# Altium schematic sheet PWR612A_SH1.SchDoc: TPS23861EVM Motherboard
size 558 x 431 mm; Engineer: E. Wright; Revision: A; Name: E. Wright
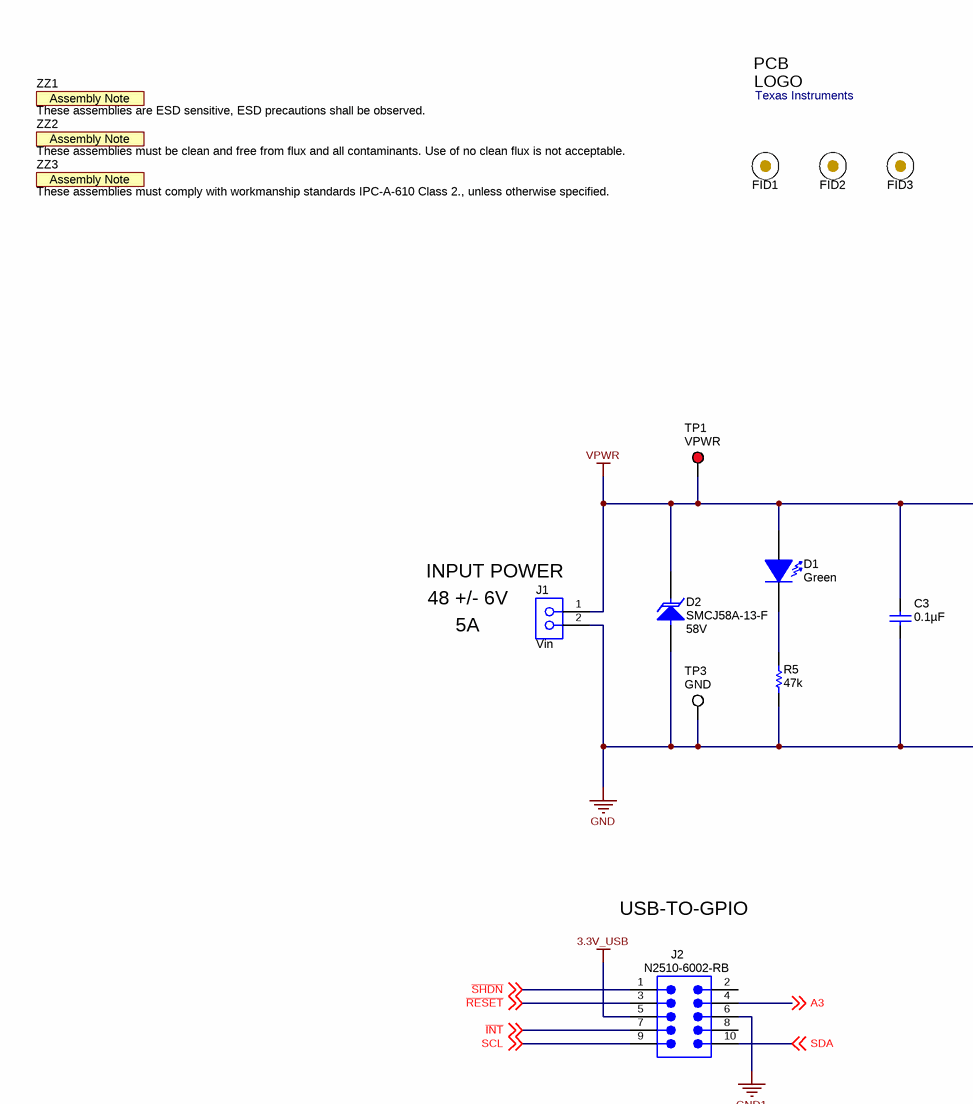
[diagram p0: PWR612A_SH1.SchDoc, top left]
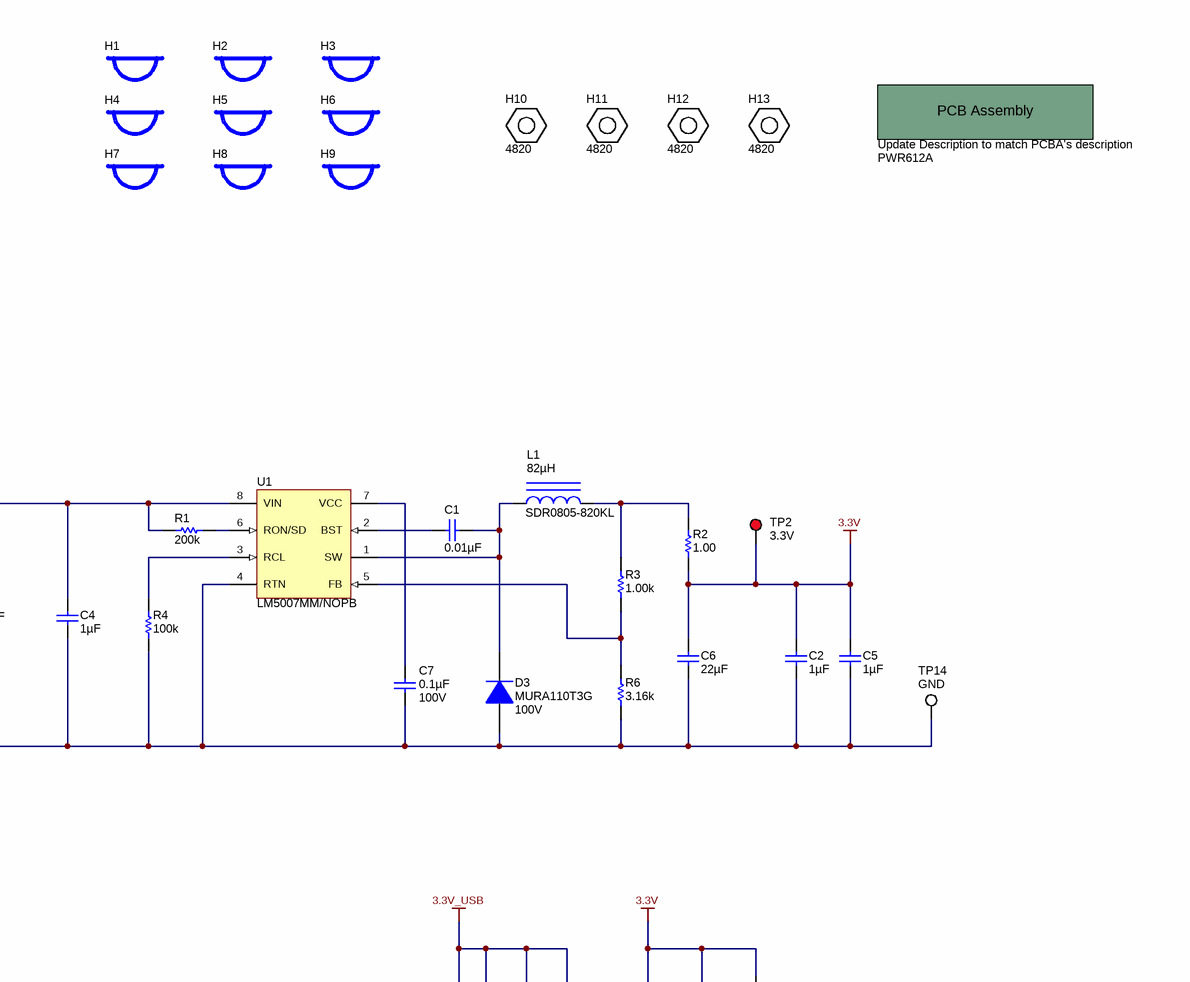
[diagram p1: PWR612A_SH1.SchDoc, top right]
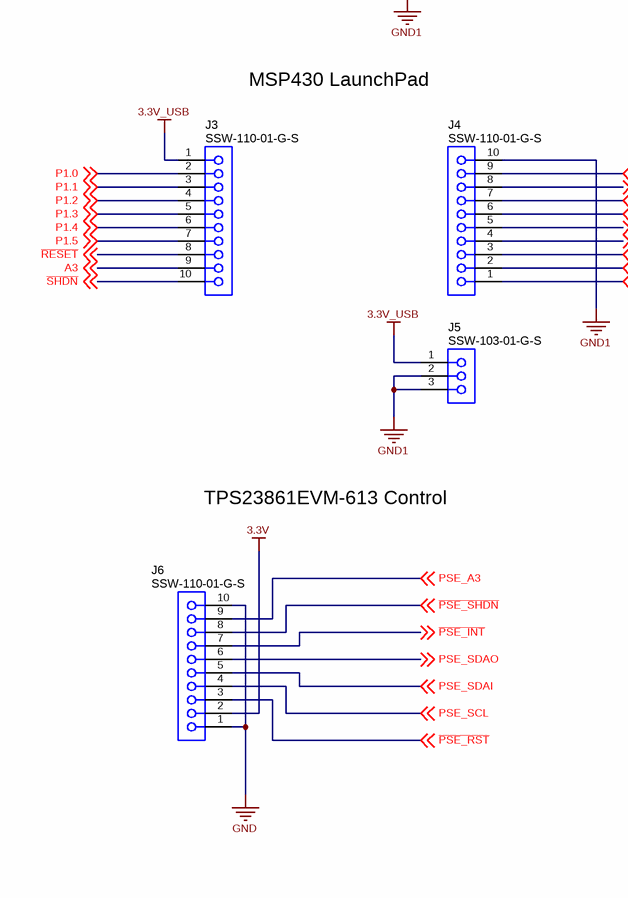
[diagram p2: PWR612A_SH1.SchDoc, bottom left]
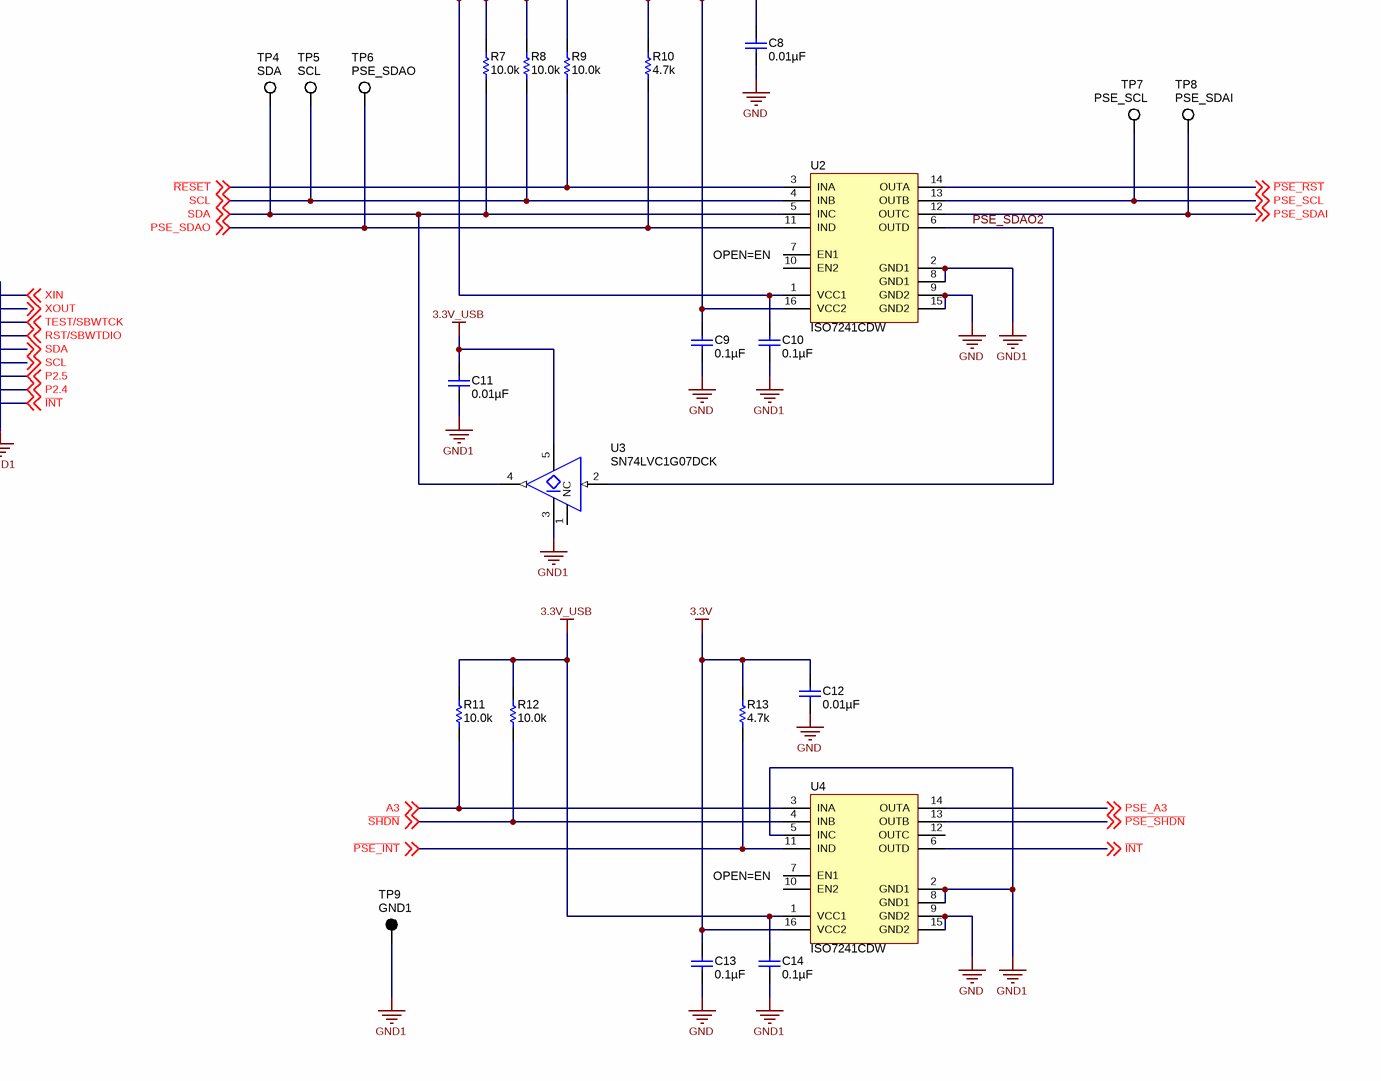
[diagram p3: PWR612A_SH1.SchDoc, bottom right]

## Parts
!PCBA?  Update Description to match PCBA's description  PartNumber: PWR612A  (mechanical)
C1  ValueDisplayed: 0.01µF  [0603]  (hidden comment: 06031C103KAT2A)
C2  ValueDisplayed: 1µF  [0805]  (hidden comment: 0805ZC105KAT2A)
C3  ValueDisplayed: 0.1µF  [0805_HV]  (hidden comment: C2012X7R2A104K)
C4  ValueDisplayed: 1µF  [1206]  (hidden comment: GRM31CR72A105KA01L)
C5  ValueDisplayed: 1µF  [0805]  (hidden comment: 0805ZC105KAT2A)
C6  ValueDisplayed: 22µF  [1206]  (hidden comment: GRM31CR71A226KE15L)
C7  ValueDisplayed: 0.1µF  Value2: 100V  [0805_HV]  (hidden comment: C2012X7R2A104K)
C8  ValueDisplayed: 0.01µF  [0603]  (hidden comment: 06031C103KAT2A)
C9  ValueDisplayed: 0.1µF  [0603]  (hidden comment: 06035C104KAT2A)
C10  ValueDisplayed: 0.1µF  [0603]  (hidden comment: 06035C104KAT2A)
C11  ValueDisplayed: 0.01µF  [0603]  (hidden comment: 06031C103KAT2A)
C12  ValueDisplayed: 0.01µF  [0603]  (hidden comment: 06031C103KAT2A)
C13  ValueDisplayed: 0.1µF  [0603]  (hidden comment: 06035C104KAT2A)
C14  ValueDisplayed: 0.1µF  [0603]  (hidden comment: 06035C104KAT2A)
D1  value Green  [LED_PowerTOPLED_CB_lens]  (hidden comment: LT E63C-CADB-35-L-Z)
D2  SMCJ58A-13-F  value 58V  [SMC]
D3  MURA110T3G  value 100V  [SMA]
FID1  Fiducial  [Fiducial10-20]  (value not drawn)  (no BOM)
FID2  Fiducial  [Fiducial10-20]  (value not drawn)  (no BOM)
FID3  Fiducial  [Fiducial10-20]  (value not drawn)  (no BOM)
H1  SJ61A1  [Bumpon_SJ61A1]  (value not drawn)
H2  SJ61A1  [Bumpon_SJ61A1]  (value not drawn)
H3  SJ61A1  [Bumpon_SJ61A1]  (value not drawn)
H4  SJ61A1  [Bumpon_SJ61A1]  (value not drawn)
H5  SJ61A1  [Bumpon_SJ61A1]  (value not drawn)
H6  SJ61A1  [Bumpon_SJ61A1]  (value not drawn)
H7  SJ61A1  [Bumpon_SJ61A1]  (value not drawn)
H8  SJ61A1  [Bumpon_SJ61A1]  (value not drawn)
H9  SJ61A1  [Bumpon_SJ61A1]  (value not drawn)
H10  4820  [KEYSTONE_4820]
H11  4820  [KEYSTONE_4820]
H12  4820  [KEYSTONE_4820]
H13  4820  [KEYSTONE_4820]
J1  Vin  [CONN_ED120-2DS]
J2  N2510-6002-RB  [CONN_2510-6002]
J3  SSW-110-01-G-S  [CONN_SSW-110-23-F-S]
J4  SSW-110-01-G-S  [CONN_SSW-110-23-F-S]
J5  SSW-103-01-G-S  [CONN_SSW-103-01-G-S]
J6  SSW-110-01-G-S  [CONN_SSW-110-23-F-S]
L1  SDR0805-820KL  ValueDisplayed: 82µH  [SDR0805]
Logo1  Texas Instruments  [TI_Stacked_Overlay_Medium]  (no BOM)
R1  value 200k  [0603]  (hidden comment: CRCW0603200KFKEA)
R2  value 1.00  [1206]  (hidden comment: CRCW12061R00FKEA)
R3  value 1.00k  [0603]  (hidden comment: CRCW06031K00FKEA)
R4  value 100k  [0603]  (hidden comment: CRCW0603100KFKEA)
R5  value 47k  [0603]  (hidden comment: CRCW060347K0JNEA)
R6  value 3.16k  [0603]  (hidden comment: CRCW06033K16FKEA)
R7  value 10.0k  [0603]  (hidden comment: CRCW060310K0FKEA)
R8  value 10.0k  [0603]  (hidden comment: CRCW060310K0FKEA)
R9  value 10.0k  [0603]  (hidden comment: CRCW060310K0FKEA)
R10  value 4.7k  [0603]  (hidden comment: CRCW06034K70JNEA)
R11  value 10.0k  [0603]  (hidden comment: CRCW060310K0FKEA)
R12  value 10.0k  [0603]  (hidden comment: CRCW060310K0FKEA)
R13  value 4.7k  [0603]  (hidden comment: CRCW06034K70JNEA)
TP1  VPWR  [Keystone5010]
TP2  3.3V  [Keystone5010]
TP3  GND  [Testpoint_Keystone_Compact]
TP4  SDA  [Keystone5012]
TP5  SCL  [Keystone5012]
TP6  PSE_SDAO  [Keystone5012]
TP7  PSE_SCL  [Keystone5012]
TP8  PSE_SDAI  [Keystone5012]
TP9  GND1  [Keystone5011]
TP14  GND  [Testpoint_Keystone_Compact]
U1  LM5007MM/NOPB  [MUA08A_N]
U2  ISO7241CDW  [DW0016A_N]
U3  SN74LVC1G07DCK  [DCK0005A_N]
U4  ISO7241CDW  [DW0016A_N]
ZZ1  These assemblies are ESD sensitive, ESD precautions shall be observed.  [AssemblyNote]  (no BOM)
ZZ2  These assemblies must be clean and free from flux and all contaminants. Use of no clean flux is not acceptable.  [AssemblyNote]  (no BOM)
ZZ3  These assemblies must comply with workmanship standards IPC-A-610 Class 2., unless otherwise specified.  [AssemblyNote]  (no BOM)

## Nets
3.3V: C2.1 C5.1 C6.1 C8.2 C9.1 C12.2 C13.1 J6.2 R2.2 R10.2 R13.2 TP2.1 U2.16(VCC2) U4.16(VCC2)
3.3V_USB: C10.1 C11.2 C14.1 J2.5 J3.1 J5.1 R7.2 R8.2 R9.2 R11.2 R12.2 U2.1(VCC1) U3.5(VCC) U4.1(VCC1)
GND: C2.2 C3.2 C4.2 C5.2 C6.2 C7.2 C8.1 C9.2 C12.1 C13.2 D2.2(A) D3.2(A) J1.2 J6.1 J6.10 R4.1 R5.1 R6.1 TP3.1 TP14.1 U1.4(RTN) U2.9(GND2) U2.15(GND2) U4.9(GND2) U4.15(GND2)
GND1: C10.2 C11.1 C14.2 J2.6 J4.10 J5.2 J5.3 TP9.1 U2.2(GND1) U2.8(GND1) U3.3(GND) U4.2(GND1) U4.5(INC) U4.8(GND1)
VPWR: C3.1 C4.1 D1.4(A) D2.1(K) J1.1 R1.1 TP1.1 U1.8(VIN)
~{INT}: J2.7 J4.1 U4.6(OUTD) ; off-sheet ~{INT}
~{PSE_INT}: J6.7 R13.1 U4.11(IND) ; off-sheet ~{PSE_INT}
~{PSE_RST}: J6.3 U2.14(OUTA) ; off-sheet ~{PSE_RST}
~{PSE_SHDN}: J6.8 U4.13(OUTB) ; off-sheet ~{PSE_SHDN}
~{RESET}: J2.3 J3.8 R9.1 U2.3(INA) ; off-sheet ~{RESET}
~{SHDN}: J2.1 J3.10 R12.1 U4.4(INB) ; off-sheet ~{SHDN}
A3: J2.4 J3.9 R11.1 U4.3(INA) ; off-sheet A3
P1.0: J3.2 ; off-sheet P1.0
P1.1: J3.3 ; off-sheet P1.1
P1.2: J3.4 ; off-sheet P1.2
P1.3: J3.5 ; off-sheet P1.3
P1.4: J3.6 ; off-sheet P1.4
P1.5: J3.7 ; off-sheet P1.5
P2.4: J4.2 ; off-sheet P2.4
P2.5: J4.3 ; off-sheet P2.5
PSE_A3: J6.9 U4.14(OUTA) ; off-sheet PSE_A3
PSE_SCL: J6.4 TP7.1 U2.13(OUTB) ; off-sheet PSE_SCL
PSE_SDAI: J6.5 TP8.1 U2.12(OUTC) ; off-sheet PSE_SDAI
PSE_SDAO: J6.6 R10.1 TP6.1 U2.11(IND) ; off-sheet PSE_SDAO
PSE_SDAO2: U2.6(OUTD) U3.2(A)
RST/SBWTDIO: J4.6 ; off-sheet RST/SBWTDIO
SCL: J2.9 J4.4 R8.1 TP5.1 U2.4(INB) ; off-sheet SCL
SDA: J2.10 J4.5 R7.1 TP4.1 U2.5(INC) U3.4(Y) ; off-sheet SDA
TEST/SBWTCK: J4.7 ; off-sheet TEST/SBWTCK
XIN: J4.9 ; off-sheet XIN
XOUT: J4.8 ; off-sheet XOUT
NetC1_1: C1.1 U1.2(BST)
NetC1_2: C1.2 D3.1(K) L1.1 U1.1(SW)
NetC7_1: C7.1 U1.7(VCC)
NetD1_2: D1.2(K) R5.2
NetL1_2: L1.2 R2.1 R3.2
NetR1_2: R1.2 U1.6(RON/SD)
NetR3_1: R3.1 R6.2 U1.5(FB)
NetR4_2: R4.2 U1.3(RCL)

Not connected (* = marked no-connect by the designer): J2 2 8; U2 7(EN1) 10(EN2); U3 1(NC); U4 7(EN1) 10(EN2) 12(OUTC)

## Notes on the sheet
- (near J1) 48 +/- 6V
- (near J1) INPUT POWER
- 5A
- USB-TO-GPIO
- MSP430 LaunchPad
- (near U2) OPEN=EN
- TPS23861EVM-613 Control
- (near U4) OPEN=EN
- Drawn By:
- SVN Rev:
- Number:
- Rev:
- Sheet Title:
- File:
- Project Title:
- Designed for:
- Assembly Variant:
- Mod. Date:
- Sheet:
- Size:
- of
- C
- http://www.ti.com
- Texas Instruments and/or its licensors do not warrant the accuracy or completeness of this specification or any information contained therein. Texas Instruments and/or its licensors do not warrant that this design will meet the specifications, will be suitable for your application or fit for any particular purpose, or will operate in an implementation. Texas Instruments and/or its licensors do not warrant that the design is production worthy. You should completely validate and test your design implementation to confirm the system functionality for your application.
- Engineer:
- Contact:
- © Texas Instruments
- (in symbol AssemblyNote) Assembly Note
- (in symbol PCBA) PCB Assembly
- (in symbol TI_Logo) PCB; LOGO

## Library data of the parts
!PCBA? = PCBA: Manufacturer: Any; SymbolCreator: a0412235; U/M: EA; SymbolVersion: 2012-09-03; PackageReference: N/A; RoHS: Y; MountType: N/A; CompType: PCBA; ComponentLink1URL: Paste URL for datasheet here; Publisher: Texas Instruments; LatestRevisionDate: 2013-12-05; LatestRevisionNote: Added Alternate PartNumber and Alternate Manufacturer parameters to appropriate components.
C1 C8 C11 C12 = 06031C103KAT2A: CAP, CERM, 0.01uF, 100V, +/-10%, X7R, 0603; Manufacturer: AVX; Polarized: N; CompType: Capacitor; U/M: EA; Cap_F: 0.00000001; Tolerance_%: 10; ESR_Ohm: 0.098; Value1: 0.098 ohm; VDC_V: 100; TaMin_C: -55; TaMax_C: 125; SymbolVersion: 2008-07-09; Value: 0.01uF; PartNumber: 06031C103KAT2A; PackageReference: 0603; RoHS: Y; Value2: 100V; MountType: SMT; Technology: Ceramic; TempCo: X7R; Cap_Case: 0603; Published: 2008-06-19; Publisher: Texas Instruments; LatestRevisionDate: 2013-07-02; ComponentLink1Description: Datasheet link; ComponentLink1URL: http://www.avx.com/docs/masterpubs/smccp.pdf; Supplier 1: Digi-Key; Supplier Part Number 1: 478-1205-1-ND; Supplier 2: Mouser; Supplier Part Number 2: 581-06031C103K; Supplier 3: Farnell; Supplier Part Number 3: 1327671
C2 C5 = 0805ZC105KAT2A: CAP, CERM, 1uF, 10V, +/-10%, X7R, 0805; Manufacturer: AVX; Polarized: N; CompType: Capacitor; U/M: EA; Cap_F: 0.000001; Tolerance_%: 10; ESR_Ohm: 0.008; Value1: 0.008 ohm; TaMin_C: -55; TaMax_C: 125; SymbolVersion: 2008-07-09; Value: 1uF; PartNumber: 0805ZC105KAT2A; PackageReference: 0805; RoHS: Y; VDC_V: 10; Value2: 10V; MountType: SMT; Technology: Ceramic; TempCo: X7R; Cap_Case: 0805; Published: 2008-06-19; Publisher: Texas Instruments; LatestRevisionDate: 2013-07-02; ComponentLink1Description: Datasheet link; ComponentLink1URL: http://www.avx.com/docs/masterpubs/smccp.pdf; Supplier 1: Digi-Key; Supplier Part Number 1: 478-1405-1-ND; Supplier 2: Mouser; Supplier Part Number 2: 581-0805ZC105K; Supplier 3: Farnell; Supplier Part Number 3: 1327700
C3 C7 = C2012X7R2A104K: CAP, CERM, 0.1uF, 100V, +/-10%, X7R, 0805; Manufacturer: TDK; Polarized: N; CompType: Capacitor; U/M: EA; Cap_F: 0.0000001; Tolerance_%: 10; ESR_Ohm: 0.0158; Value1: 0.0158 ohm; VDC_V: 100; TaMin_C: -55; TaMax_C: 125; Cap_Case: 0805; SymbolVersion: 2008-07-09; Value: 0.1uF; PartNumber: C2012X7R2A104K; PackageReference: 0805; RoHS: Y; MountType: SMT; Technology: Ceramic; TempCo: X7R; Published: 2008-06-19; Publisher: Texas Instruments; LatestRevisionDate: 2013-06-14; ComponentLink1Description: Datasheet link; ComponentLink1URL: http://www.tdk.co.jp/tefe02/e412_c.pdf; Supplier 1: Digi-Key; Supplier Part Number 1: 445-1418-1-ND; Supplier 2: Farnell; Supplier Part Number 2: 1844410
  C3: Value2: 100V
C4 = GRM31CR72A105KA01L: CAP, CERM, 1uF, 100V, +/-10%, X7R, 1206; Manufacturer: MuRata; Polarized: N; CompType: Capacitor; U/M: EA; Cap_F: 0.000001; Tolerance_%: 10; Value1: Unknown; VDC_V: 100; TaMin_C: -55; TaMax_C: 125; Cap_Case: 2220; SymbolVersion: 2008-07-09; Value: 1uF; PartNumber: GRM31CR72A105KA01L; PackageReference: 1206; RoHS: Y; Value2: 100V; MountType: SMT; Technology: Ceramic; TempCo: X7R; Published: 2008-06-19; Publisher: Texas Instruments; LatestRevisionDate: 2013-07-02; ComponentLink1Description: Datasheet link; ComponentLink1URL: http://search.murata.co.jp/Ceramy/PnsearchViewAction.do?HnOFG=ON&HnNFG=ON&SEL_CNT=50&sLang=en&sKey=GRM31CR72A105KA01L&x=9&y=9&search=startwith; Supplier 1: Digi-Key; Supplier Part Number 1: 490-3909-1-ND; Supplier 2: Mouser; Supplier Part Number 2: 81-GRM31CR72A105KA01; Supplier 3: Farnell; Supplier Part Number 3: 1735543
C6 = GRM31CR71A226KE15L: CAP, CERM, 22uF, 10V, +/-10%, X7R, 1206; Manufacturer: MuRata; Polarized: N; CompType: Capacitor; U/M: EA; Cap_F: 0.000022; Tolerance_%: 10; Value1: Unknown; TaMin_C: -55; TaMax_C: 125; SymbolVersion: 2008-07-09; Value: 22uF; PartNumber: GRM31CR71A226KE15L; PackageReference: 1206; RoHS: Y; VDC_V: 10; Value2: 10V; MountType: SMT; Technology: Ceramic; TempCo: X7R; Cap_Case: 1206; Published: 2008-06-19; Publisher: Texas Instruments; LatestRevisionDate: 2013-12-06; ComponentLink1Description: Datasheet link; ComponentLink1URL: http://search.murata.co.jp/Ceramy/PnsearchViewAction.do?HnOFG=ON&HnNFG=ON&SEL_CNT=50&sLang=en&sKey=GRM31CR71A226KE15L&x=9&y=9&search=startwith; Supplier 1: Digi-Key; Supplier Part Number 1: 490-5309-1-ND; Supplier 2: Mouser; Supplier Part Number 2: 81-GRM31CR71A226K15L; Supplier 3: Farnell; Supplier Part Number 3: 1797016
C9 C10 C13 C14 = 06035C104KAT2A: CAP, CERM, 0.1uF, 50V, +/-10%, X7R, 0603; Manufacturer: AVX; Polarized: N; CompType: Capacitor; U/M: EA; Cap_F: 0.0000001; Tolerance_%: 10; Value1: Unknown; VDC_V: 50; TaMin_C: -55; TaMax_C: 125; SymbolVersion: 2008-07-09; Value: 0.1uF; PartNumber: 06035C104KAT2A; PackageReference: 0603; RoHS: Y; Value2: 50V; MountType: SMT; Technology: Ceramic; TempCo: X7R; Cap_Case: 0603; Published: 2008-06-19; Publisher: Texas Instruments; LatestRevisionDate: 2013-08-08; ComponentLink1Description: Datasheet link; ComponentLink1URL: http://www.avx.com/docs/Catalogs/cx7r.pdf; Supplier 1: Digi-Key; Supplier Part Number 1: 478-5052-1-ND; Supplier 2: Mouser; Supplier Part Number 2: 581-06035C104KAT2A; Supplier 3: Farnell; Supplier Part Number 3: 1301804
D1 = LT E63C-CADB-35-L-Z: LED, Green, SMD; Manufacturer: OSRAM; Type: InGaN; Vf_V: 3.8; Value2: 3.8V; Io_A: 0.03; Vr_V: 5; RJC_CperW: 180; Tjmax_C: 125; Power_TotalModule: 0.114; Value1: 0.114W; LambdaP: 520; LambdaD: 525; NumParallelLEDs: 1; LuminousFlux_PhiV: 1.482; Angle: 20; FamilyName: Power TOPLED&#174;; U/M: EA; CompType: LED; PartNumber: LT E63C-CADB-35-L-Z; SymbolVersion: 2009-06-29; MountType: SMT; RoHS: Y; PackageReference: Power TOPLED w/lens; NumSeriesLEDs: 1; Color: green; Family_Io: 0.03; Published: 2008-07-11; Publisher: Texas Instruments; ComponentLink1URL: http://catalog.osram-os.com/catalogue/catalogue.do?act=showBookmark&favOid=0000000000029555000a003a; ComponentLink1Description: Datasheet link; LatestRevisionDate: 2013-07-17; LatestRevisionNote: Updated supplier queries; Supplier 1: Digi-Key; Supplier Part Number 1: 475-2773-1-ND; Supplier 2: Mouser; Supplier Part Number 2: 720-LTE63CCADB351Z
D2 = SMBJ58A-13-F: Diode, TVS, Uni, 58V, 600W, SMB; Manufacturer: Diodes Inc.; U/M: EA; Power_W: 5; Vr_V: 58; Value1: 5W; CompType: TVS; SymbolVersion: 2012-01-13; PartNumber: SMCJ58A-13-F; PackageReference: SMC; Vz_V: N/A; MountType: SMT; RoHS: Y; ComponentLink1Description: Datasheet link; ComponentLink1URL: http://www.diodes.com/datasheets/ds19002.pdf; Published: 2008-10-08; Publisher: Texas Instruments; LatestRevisionDate: 2013-01-09; LatestRevisionNote: Updated Supplier Data; Supplier 1: Digi-Key; Supplier Part Number 1: SMBJ58A-FDICT-ND; Supplier 2: Mouser; Supplier Part Number 2: 621-SMBJ58A-13-F
D3 = MURA120T3G: Diode, Ultrafast, 100V, 1A, SMA; Manufacturer: ON Semiconductor; U/M: EA; Vf_V: 0.0875; Value2: 0.0875V; Io_A: 1; Vr_V: 100; TJmax_C: 175; SymbolVersion: 2008-12-08; PartNumber: MURA110T3G; PackageReference: SMA; CompType: Diode; Value1: 1A; MountType: SMT; Type: Ultrafast; RoHS: Y; Published: 2008-06-26; Publisher: Texas Instruments; LatestRevisionDate: 2013-07-17; ComponentLink1Description: Datasheet link; ComponentLink1URL: http://www.onsemi.com/pub_link/Collateral/MURA115T3-D.PDF; Supplier 1: Digi-Key; Supplier Part Number 1: MURA110T3GOSCT-ND; Supplier 2: Mouser; Supplier Part Number 2: 863-MURA110T3G; Supplier 3: Farnell; Supplier Part Number 3: 1459147
FID1-FID3 = Fiducial: Fiducial mark.  There is nothing to buy or mount.; SymbolCreator: codlsc; SymbolVersion: 2009-11-4; CompType: Fiducial; PackageReference: Fiducial; ClassName: FiducialMark; Manufacturer: N/A; PartNumber: N/A; MountType: N/A; Publisher: Texas Instruments; LatestRevisionDate: 2012-11-28; LatestRevisionNote: Added Alternate PartNumber and Alternate Manufacturer parameters to appropriate components.
H1-H9 = SJ61A1: Bumpon, Cylindrical, 0.312 X 0.200, Black; Manufacturer: 3M; SymbolCreator: a0412235; SymbolVersion: 2012-03-04; ClassName: Bumpon; CompType: Bumpon; PartNumber: SJ61A1; RoHS: Y; PackageReference: Black Bumpon; MountType: N/A; ComponentLink1Description: Datasheet Link; ComponentLink1URL: http://multimedia.3m.com/mws/mediawebserver?mwsId=66666UF6EVsSyXTtOxTXoxMtEVtQEVs6EVs6EVs6E666666--&fn=SJxxA1.pdf; Publisher: Texas Instruments; LatestRevisionDate: 2013-12-04; Supplier 1: Digi-Key; Supplier Part Number 1: SJ5746-0-ND; Supplier 2: Mouser; Supplier Part Number 2: 517-SJ-61A1
H10-H13 = 4820: Standoff, Hex, 1"L #6-32 Nylon, M-F; Manufacturer: Keystone; SymbolCreator: a0412235; SymbolVersion: 2013-11-25; CompType: Standoff; PartNumber: 4820; RoHS: Y; PackageReference: 1" Nylon Hex Standoff; MountType: N/A; ComponentLink1Description: Datasheet Link; ComponentLink1URL: http://www.keyelco.com/userAssets/file/M60-2p70.pdf; Publisher: Texas Instruments; LatestRevisionDate: 2013-12-17; Supplier 1: Digi-Key; Supplier Part Number 1: 4820K-ND; Supplier 2: Mouser; Supplier Part Number 2: 534-4820; Supplier 3: Farnell; Supplier Part Number 3: 1093101
J1 = ED120/2DS: TERMINAL BLOCK 5.08MM VERT 2POS; Manufacturer: On-Shore Technology, Inc.; U/M: EA; SymbolVersion: 2010-10-20; PartNumber: ED120/2DS; CompType: Terminal Block; RoHS: Y; PackageReference: TERM_BLK, 2pos, 5.08mm; MountType: TH; ComponentLink1Description: Datasheet Link; ComponentLink1URL: http://www.on-shore.com/sites/default/files/manuals/ed120ds.pdf; Publisher: Texas Instruments; LatestRevisionDate: 2013-04-26; Supplier 1: Digi-Key; Supplier Part Number 1: ED1609-ND
J2 = N2510-6002-RB: Header (shrouded), 100mil, 5x2, High-Temperature, Gold, TH; Manufacturer: 3M; SymbolCreator: a0412235; CompType: Connector; U/M: EA; SymbolVersion: 2013-03-14; PartNumber: N2510-6002-RB; RoHS: Y; PackageReference: 5x2 Shrouded header; MountType: TH; ComponentLink1Description: Datasheet Link; ComponentLink1URL: http://multimedia.3m.com/mws/mediawebserver?mwsId=66666UF6EVsSyXTtMXM6MxfcEVtQEVs6EVs6EVs6E666666--&fn=ts0770.pdf; Publisher: Texas Instruments; LatestRevisionDate: 2013-04-26; Supplier 1: Digi-Key; Supplier Part Number 1: MHC10K-ND; Supplier 2: Mouser; Supplier Part Number 2: 517-N2510-6002RB; Supplier 3: Farnell; Supplier Part Number 3: 9838244
J3 J4 J6 = SSW-110-23-F-S: Connector, Receptacle, 100mil, 10x1, Gold plated, TH; Manufacturer: Samtec, Inc.; SymbolCreator: a0411947; U/M: EA; SymbolVersion: 2013-01-28; PartNumber: SSW-110-01-G-S; CompType: Connector; RoHS: Y; PackageReference: HEADER, RECEPTACLE, 100mil, 10x1; MountType: TH; ComponentLink1Description: Datasheet Link; ComponentLink1URL: http://www.samtec.com/technical-specifications/default.aspx?SeriesMaster=SSW; Publisher: Texas Instruments; LatestRevisionDate: 2013-04-26; Supplier 1: Digi-Key; Supplier Part Number 1: SAM1209-10-ND
J5 = SSW-103-01-G-S: Receptacle 100mil 3x1, Gold, TH; Manufacturer: Samtec, Inc.; SymbolCreator: a0412235; U/M: EA; SymbolVersion: 2013-02-28; PartNumber: SSW-103-01-G-S; CompType: Receptacle; RoHS: Y; PackageReference: Receptacle, 100mil, 3x1; MountType: TH; ComponentLink1Description: Datasheet Link; ComponentLink1URL: http://www.samtec.com/documents/webfiles/cpdf/SSW-1XX-XX-XXX-X-XX-XXX-XX-MKT.pdf; Publisher: Texas Instruments; LatestRevisionDate: 2013-05-09; Supplier 1: Digi-Key; Supplier Part Number 1: SAM1209-03-ND; Supplier 2: Farnell; Supplier Part Number 2: 1668337; Supplier 3: Newark; Supplier Part Number 3: 15P2873
L1 = SDR0805-820KL: Inductor, Drum Core, Ferrite, 82uH, 0.78A, 0.37 ohm, SMD; Manufacturer: Bourns; Alternate Manufacturer: Wurth Elektronik; Alternate PartNumber: 744787820; Ind_H: 82.0E-6; Imax_A: 0.78; Irms: 0.78A @ 40C rise; Isat: 1.2A @ 10% inductance drop; DCR_ohm: 0.37; U/M: EA; SymbolVersion: 2008-07-23; CompType: Inductor; Value: 82uH; PartNumber: SDR0805-820KL; PackageReference: SDR0805; Value1: 0.37 ohm; Value2: 0.78A; Technology: Drum Core; MountType: SMT; Material: Ferrite; Published: 2008-06-26; Publisher: Texas Instruments; LatestRevisionDate: 2013-05-17; ComponentLink1Description: Datasheet link; ComponentLink1URL: http://www.bourns.com/data/global/pdfs/SDR0805.pdf; RoHS: Y; Supplier 1: Digi-Key; Supplier Part Number 1: SDR0805-820KLCT-ND; Supplier 2: Mouser; Supplier Part Number 2: 652-SDR0805-820KL
Logo1 = TI_Logo: Texas Instrument Corporate Signature; SymbolCreator: codlsc; SymbolVersion: 2011-08-22; ClassName: Logo; Published: 2009-03-03; Publisher: Texas Instruments; LatestRevisionDate: 2012-05-17; LatestRevisionNote: Changed publisher
R1 = CRCW0603200KFKEA: RES, 200k ohm, 1%, 0.1W, 0603; Manufacturer: Vishay-Dale; CompType: Resistor; Res_ohm: 200000; Tolerance_%: 1; Power_W: 0.1; VDC_V: 75; TempCo: 100 ppm/C; EIA_Code: E96; U/M: EA; SymbolVersion: 2009-05-29; PartNumber: CRCW0603200KFKEA; PackageReference: 0603; RoHS: Y; Value_Code: 200k; Value1: 1%; Value2: 0.1W; MountType: SMT; Technology: Thick Film; Published: 2008-06-26; Publisher: Texas Instruments; LatestRevisionDate: 2013-01-08; ComponentLink1Description: Datasheet link; ComponentLink1URL: http://www.vishay.com/docs/20035/dcrcwe3.pdf; Supplier 1: Digi-Key; Supplier Part Number 1: 541-200KHCT-ND; Supplier 2: Mouser; Supplier Part Number 2: 71-CRCW0603-200K-E3; Supplier 3: Farnell; Supplier Part Number 3: 1469776
R2 = CRCW12061R00FKEA: RES, 1.00 ohm, 1%, 0.25W, 1206; Manufacturer: Vishay-Dale; CompType: Resistor; Res_ohm: 1; Value_Code: 1R00; Power_W: 0.25; VDC_V: 200; TempCo: 100 ppm/C; EIA_Code: E96; U/M: EA; SymbolVersion: 2009-05-29; PartNumber: CRCW12061R00FKEA; PackageReference: 1206; RoHS: Y; Tolerance_%: 1; Value1: 1%; Value2: 0.25W; MountType: SMT; Technology: Thick Film; Published: 2008-06-26; Publisher: Texas Instruments; LatestRevisionDate: 2013-07-11; ComponentLink1Description: Datasheet link; ComponentLink1URL: http://www.vishay.com/docs/20035/dcrcwe3.pdf; Supplier 1: Mouser; Supplier Part Number 1: 71-CRCW1206-1-E3; Supplier 2: Farnell; Supplier Part Number 2: 1653087; Supplier 3: Newark; Supplier Part Number 3: 53K1855
R3 = CRCW06031K00FKEA: RES, 1.00k ohm, 1%, 0.1W, 0603; Manufacturer: Vishay-Dale; CompType: Resistor; Res_ohm: 1000; Value_Code: 1k00; Tolerance_%: 1; Power_W: 0.1; VDC_V: 75; TempCo: 100 ppm/C; EIA_Code: E96; U/M: EA; SymbolVersion: 2009-05-29; PartNumber: CRCW06031K00FKEA; PackageReference: 0603; RoHS: Y; Value1: 1%; Value2: 0.1W; MountType: SMT; Technology: Thick Film; Published: 2008-06-26; Publisher: Texas Instruments; LatestRevisionDate: 2013-01-08; ComponentLink1Description: Datasheet link; ComponentLink1URL: http://www.vishay.com/docs/20035/dcrcwe3.pdf; Supplier 1: Digi-Key; Supplier Part Number 1: 541-1.00KHCT-ND; Supplier 2: Mouser; Supplier Part Number 2: 71-CRCW0603-1.0K-E3; Supplier 3: Farnell; Supplier Part Number 3: 1469740
R4 = CRCW0603100KFKEA: RES, 100k ohm, 1%, 0.1W, 0603; Manufacturer: Vishay-Dale; CompType: Resistor; Res_ohm: 100000; Tolerance_%: 1; Power_W: 0.1; VDC_V: 75; TempCo: 100 ppm/C; EIA_Code: E96; U/M: EA; SymbolVersion: 2009-05-29; PartNumber: CRCW0603100KFKEA; PackageReference: 0603; RoHS: Y; Value_Code: 100k; Value1: 1%; Value2: 0.1W; MountType: SMT; Technology: Thick Film; Published: 2008-06-26; Publisher: Texas Instruments; LatestRevisionDate: 2013-01-08; ComponentLink1Description: Datasheet link; ComponentLink1URL: http://www.vishay.com/docs/20035/dcrcwe3.pdf; Supplier 1: Digi-Key; Supplier Part Number 1: 541-100KHCT-ND; Supplier 2: Mouser; Supplier Part Number 2: 71-CRCW0603-100K-E3; Supplier 3: Farnell; Supplier Part Number 3: 1469649
R5 = CRCW060347K0JNEA: RES, 47k ohm, 5%, 0.1W, 0603; Manufacturer: Vishay-Dale; CompType: Resistor; Res_ohm: 47000; Value_Code: 47k0; Tolerance_%: 5; Power_W: 0.1; VDC_V: 75; TempCo: 200 ppm/C; EIA_Code: E24; U/M: EA; SymbolVersion: 2009-05-29; PartNumber: CRCW060347K0JNEA; PackageReference: 0603; RoHS: Y; Value1: 5%; Value2: 0.1W; MountType: SMT; Technology: Thick Film; Published: 2008-06-26; Publisher: Texas Instruments; LatestRevisionDate: 2013-01-08; ComponentLink1Description: Datasheet link; ComponentLink1URL: http://www.vishay.com/docs/20035/dcrcwe3.pdf; Supplier 1: Digi-Key; Supplier Part Number 1: 541-47KGCT-ND; Supplier 2: Mouser; Supplier Part Number 2: 71-CRCW060347K0JNEA; Supplier 3: Farnell; Supplier Part Number 3: 1652881
R6 = CRCW06033K16FKEA: RES, 3.16k ohm, 1%, 0.1W, 0603; Manufacturer: Vishay-Dale; CompType: Resistor; Res_ohm: 3160; Value_Code: 3k16; Tolerance_%: 1; Power_W: 0.1; VDC_V: 75; TempCo: 100 ppm/C; EIA_Code: E96; U/M: EA; SymbolVersion: 2009-05-29; PartNumber: CRCW06033K16FKEA; PackageReference: 0603; RoHS: Y; Value1: 1%; Value2: 0.1W; MountType: SMT; Technology: Thick Film; Published: 2008-06-26; Publisher: Texas Instruments; LatestRevisionDate: 2013-01-08; ComponentLink1Description: Datasheet link; ComponentLink1URL: http://www.vishay.com/docs/20035/dcrcwe3.pdf; Supplier 1: Digi-Key; Supplier Part Number 1: 541-3.16KHCT-ND; Supplier 2: Mouser; Supplier Part Number 2: 71-CRCW0603-3.16K-E3; Supplier 3: Farnell; Supplier Part Number 3: 1469792
R7-R9 R11 R12 = CRCW060310K0FKEA: RES, 10.0k ohm, 1%, 0.1W, 0603; Manufacturer: Vishay-Dale; CompType: Resistor; Res_ohm: 10000; Value_Code: 10k0; Tolerance_%: 1; Power_W: 0.1; VDC_V: 75; TempCo: 100 ppm/C; EIA_Code: E96; U/M: EA; SymbolVersion: 2009-05-29; PartNumber: CRCW060310K0FKEA; PackageReference: 0603; RoHS: Y; Value1: 1%; Value2: 0.1W; MountType: SMT; Technology: Thick Film; Published: 2008-06-26; Publisher: Texas Instruments; LatestRevisionDate: 2013-07-19; ComponentLink1Description: Datasheet link; ComponentLink1URL: http://www.vishay.com/docs/20035/dcrcwe3.pdf; Supplier 1: Digi-Key; Supplier Part Number 1: 541-10.0KHCT-ND; Supplier 2: Mouser; Supplier Part Number 2: 71-CRCW0603-10K-E3; Supplier 3: Farnell; Supplier Part Number 3: 1469748
R10 R13 = CRCW06034K70JNEA: RES, 4.7k ohm, 5%, 0.1W, 0603; Manufacturer: Vishay-Dale; CompType: Resistor; Res_ohm: 4700; Value_Code: 4k70; Tolerance_%: 5; Power_W: 0.1; VDC_V: 75; TempCo: 200 ppm/C; EIA_Code: E24; U/M: EA; SymbolVersion: 2009-05-29; PartNumber: CRCW06034K70JNEA; PackageReference: 0603; RoHS: Y; Value1: 5%; Value2: 0.1W; MountType: SMT; Technology: Thick Film; Published: 2008-06-26; Publisher: Texas Instruments; LatestRevisionDate: 2013-01-08; ComponentLink1Description: Datasheet link; ComponentLink1URL: http://www.vishay.com/docs/20035/dcrcwe3.pdf; Supplier 1: Mouser; Supplier Part Number 1: 71-CRCW0603J-4.7K-E3; Supplier 2: Farnell; Supplier Part Number 2: 1652884; Supplier 3: Newark; Supplier Part Number 3: 59M6811
TP1 TP2 = 5010: Test Point, Multipurpose, Red, TH; Manufacturer: Keystone; CompType: Test Point Loop; U/M: EA; SymbolVersion: 2008-04-04; PartNumber: 5010; Value: Red; RoHS: Y; PackageReference: Keystone5010; MountType: TH; ComponentLink1Description: Datasheet Link; ComponentLink1URL: http://www.keyelco.com/userAssets/file/M60-2p60.pdf; Publisher: Texas Instruments; Supplier 1: Digi-Key; Supplier Part Number 1: 5010K-ND
  TP1: LatestRevisionDate: 2013-05-17; NetName: VPWR
  TP2: LatestRevisionDate: 2013-05-09
TP3 TP14 = 5016: Test Point, Compact, SMT; Manufacturer: Keystone; CompType: Test Point Loop; U/M: EA; SymbolVersion: 2008-04-04; PartNumber: 5016; Value: SMT; RoHS: Y; PackageReference: Testpoint_Keystone_Compact; MountType: SMT; ComponentLink1Description: Datasheet Link; ComponentLink1URL: http://www.keyelco.com/userAssets/store/files/5016.PDF; Publisher: Texas Instruments; LatestRevisionDate: 2013-05-17; Supplier 1: Digi-Key; Supplier Part Number 1: 5016KCT-ND; NetName: GND
TP4-TP8 = 5012: Test Point, Multipurpose, White, TH; Manufacturer: Keystone; CompType: Test Point Loop; U/M: EA; SymbolVersion: 2008-04-04; PartNumber: 5012; Value: White; RoHS: Y; PackageReference: Keystone5012; MountType: TH; ComponentLink1Description: Datasheet Link; ComponentLink1URL: http://www.keyelco.com/userAssets/file/M60-2p60.pdf; Publisher: Texas Instruments; LatestRevisionDate: 2013-05-09; Supplier 1: Digi-Key; Supplier Part Number 1: 5012K-ND
TP9 = 5011: Test Point, Multipurpose, Black, TH; Manufacturer: Keystone; CompType: Test Point Loop; U/M: EA; SymbolVersion: 2008-04-04; PartNumber: 5011; Value: Black; RoHS: Y; PackageReference: Keystone5011; MountType: TH; ComponentLink1Description: Datasheet Link; ComponentLink1URL: http://www.keyelco.com/userAssets/file/M60-2p60.pdf; Publisher: Texas Instruments; LatestRevisionDate: 2013-05-09; Supplier 1: Digi-Key; Supplier Part Number 1: 5011K-ND
U1 = LM5007MM/NOPB: High Voltage (80V) Step Down Switching Regulator, 8-pin MSOP, Pb-Free; Manufacturer: National Semiconductor; PackageTopMarking: ZXTT*S81B; PowerWise: N; CompType: Switcher; Published: 1-Mar-2010; DatasheetVersion: Feb-2008; PackageVersion: revF, Apr-2008; PackageReference: MUA08A; Publisher: Altium Limited; PackageDescription: MINI SOIC, .118 x .118 x .034in, 8 Lead, .0256in Pitch; Supplier 1: Digi-Key; Supplier Part Number 1: LM5007MMTR-ND; Supplier 2: Digi-Key; Supplier Part Number 2: LM5007MMCT-ND; Supplier 3: Farnell; Supplier Part Number 3: 1496179; PartNumber: LM5007MM/NOPB; RoHS: Y; PinCount: 8; Code_JEDEC: MO-187-AA; ComponentLink1Description: LM5007 Datasheet; ComponentLink1URL: http://www.national.com/ds/LM/LM5007.pdf; ComponentLink2Description: LM5007 Web Page; ComponentLink2URL: http://www.national.com/pf/LM/LM5007.html; ComponentLink3Description: MUA08A Package Page; ComponentLink3URL: http://www.national.com/packaging/folders/mua08a.html
U2 U4 = ISO7241CDW: 25 Mbps Quad Channels, 3 / 1, Digital Isolator, 3.3 V / 5 V, -40 to +125 degC, 16-pin SOIC (DW), Green (RoHS & no Sb/Br); Manufacturer: Texas Instruments; Alternate Manufacturer: None; Alternate PartNumber: Equivalent; Datarate(Mbps): 25; Eco-Plan: TBD; Input Noise Filter: Yes; Insulation Rating(VRMS): 2500; Prop Delay(Max)(ns): 42; Rating: Catalog; Supply Voltage(s)(V): 3.3, 5; TTL/CMOS Input Threshold: TTL; DatasheetVersion: SLLS868N; PackageVersion: revG, Jan-2011; PackageReference: DW0016A; PackageDescription: 16-Pin Small Outline Integrated Circuit, 10.3 x 7.5 mm, Pitch 1.27 mm Pitch; Supplier 1: Digi-Key; Supplier Part Number 1: 296-22963-5-ND; Supplier 2: Farnell; Supplier Part Number 2: 1575372; Supplier 3: Newark; Supplier Part Number 3: 73M3155; Supplier 4: Mouser; Supplier Part Number 4: 595-ISO7241CDW; Channel Configuration: 03/01/2012; SubFamily: Isolator; Thermal Shutdown: No; MountType: SMT; Code_JEDEC: MS-013-AA; PartNumber: ISO7241CDW; ComponentLink1Description: Datasheet; ComponentLink1URL: http://www.ti.com/general/docs/lit/getliterature.tsp?genericPartNumber=ISO7241C&fileType=pdf; ComponentLink2Description: URL Link1; ComponentLink2URL: SamplesURL:http://www.ti.com/product/iso7241c#samples
U3 = SN74LVC1G07DCK: SINGLE BUFFER/DRIVER WITH OPEN-DRAIN OUTPUT, DCK0005A; Alternate Manufacturer: None; Manufacturer: Texas Instruments; SymbolCreator: a0411947; CompType: IC; U/M: EA; SymbolVersion: 2013-08-14; PartNumber: SN74LVC1G07DCK; PackageReference: DCK0005A; MountType: SMT; ComponentLink1Description: Datasheet Link; ComponentLink1URL: http://www.ti.com/lit/ds/symlink/sn74lvc1g07.pdf; RoHS: Y; Publisher: Texas Instruments; LatestRevisionDate: 2013-08-15; LatestRevisionNote: Added Parts
ZZ1-ZZ3 = AssemblyNote: SymbolCreator: codlsc; SymbolVersion: 2010-05-18; CompType: AssemblyNote; ClassName: AssemblyNote; Publisher: Texas Instruments; LatestRevisionDate: 2012-06-14; LatestRevisionNote: Initial Version; Alternate Manufacturer: -; Alternate PartNumber: -